# EAGLE schematic atmega328Pruebas (EAGLE 7.6.0)
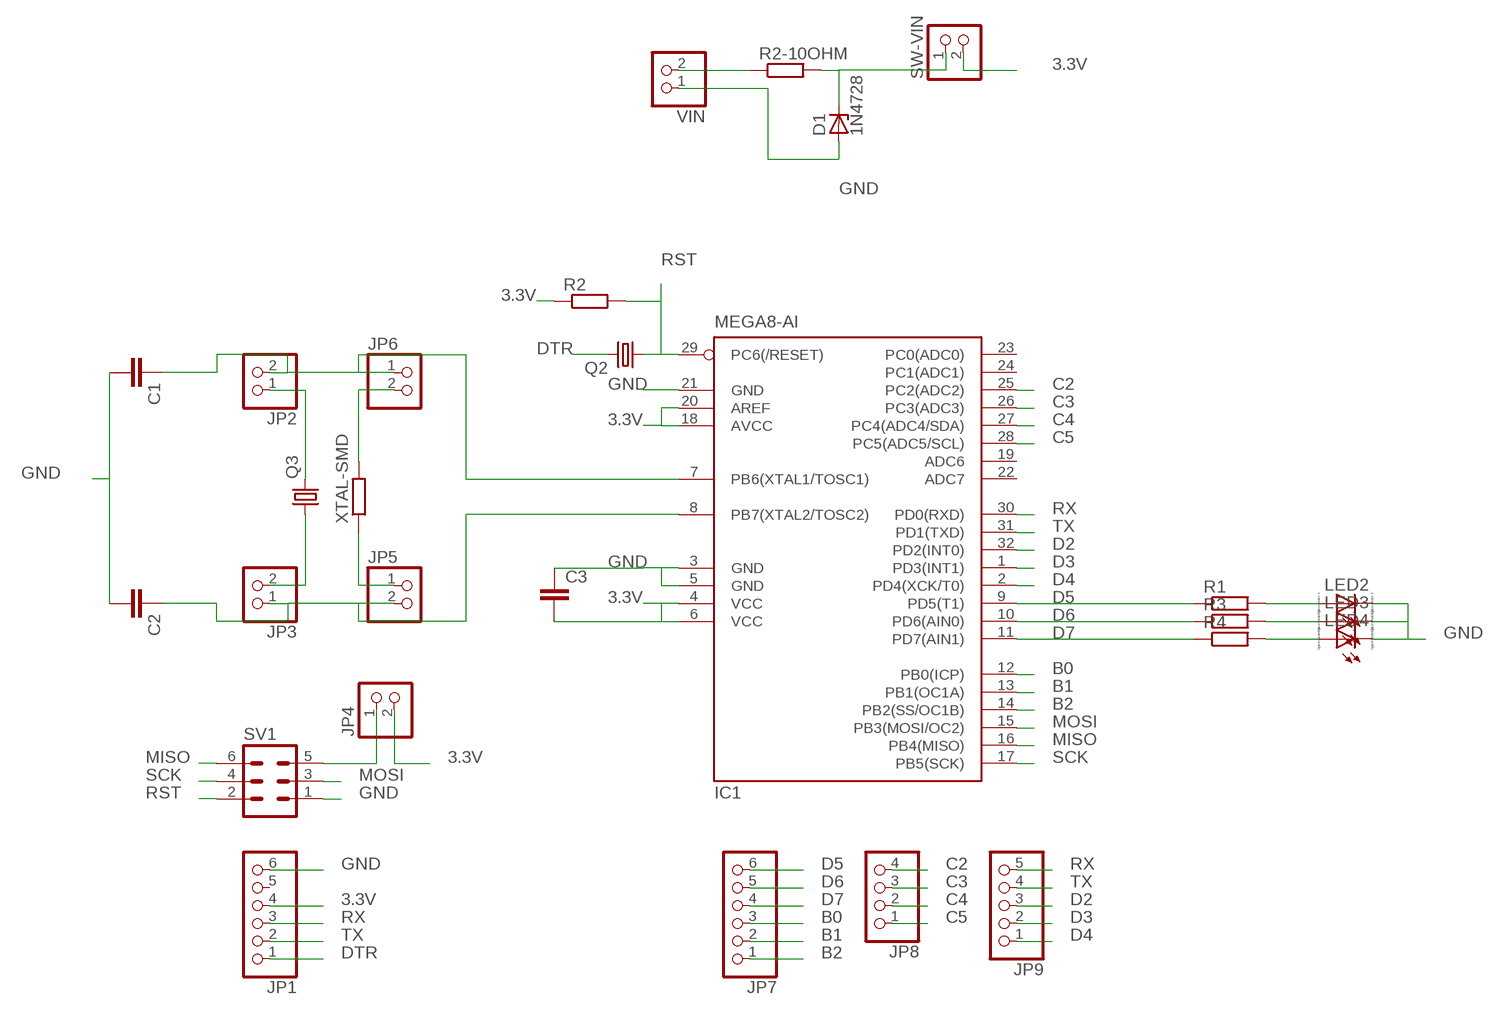
[diagram p0: schematic, sheet 1]

## Parts
C1  C-EUC0402K  [C0402K]
C2  C-EUC0402K  [C0402K]
C3  C-EUC0402K  [C0402K]
D1  1N4728  [DO41Z10]
IC1  MEGA8-AI  [TQFP32-08]
JP1  PINHD-1X6  [1X06]
JP2  PINHD-1X2  [1X02]
JP3  PINHD-1X2  [1X02]
JP4  PINHD-1X2  [1X02]
JP5  PINHD-1X2  [1X02]
JP6  PINHD-1X2  [1X02]
JP7  PINHD-1X6  [1X06]
JP8  PINHD-1X4  [1X04]
JP9  PINHD-1X5  [1X05]
LED2  LED_ESML0603  [LED_SML0603]
LED3  LED_ESML0603  [LED_SML0603]
LED4  LED_ESML0603  [LED_SML0603]
Q2  CRYSTALHC49U70  [HC49U70]
Q3  CRYSTALHC49U70  [HC49U70]
R1  R-EU_R0603  [R0603]
R2  R-EU_R0603  [R0603]
R2-10OHM  R-EU_R2512  [R2512]
R3  R-EU_R0603  [R0603]
R4  R-EU_R0603  [R0603]
SV1  MA03-2  [MA03-2]
SW-VIN  PINHD-1X2  [1X02]
VIN  PINHD-1X2  [1X02]
XTAL-SMD  R-EU_M1206  [M1206]

## Nets
3.3V: C3.2 IC1.4(VCC) IC1.6(VCC) IC1.18(AVCC) IC1.20(AREF) JP1.4 JP4.2 R2.1 SW-VIN.2
B0: IC1.12(PB0(ICP)) JP7.3
B1: IC1.13(PB1(OC1A)) JP7.2
B2: IC1.14(PB2(SS/OC1B)) JP7.1
C2: IC1.25(PC2(ADC2)) JP8.4
C3: IC1.26(PC3(ADC3)) JP8.3
C4: IC1.27(PC4(ADC4/SDA)) JP8.2
C5: IC1.28(PC5(ADC5/SCL)) JP8.1
D2: IC1.32(PD2(INT0)) JP9.3
D3: IC1.1(PD3(INT1)) JP9.2
D4: IC1.2(PD4(XCK/T0)) JP9.1
D5: IC1.9(PD5(T1)) JP7.6 R1.1
D6: IC1.10(PD6(AIN0)) JP7.5 R3.1
D7: IC1.11(PD7(AIN1)) JP7.4 R4.1
DTR: JP1.1 Q2.2
GND: C1.2 C2.2 C3.1 D1.A IC1.3(GND) IC1.5(GND) IC1.21(GND) JP1.6 LED2.C LED3.C LED4.C SV1.1 VIN.1
MISO: IC1.16(PB4(MISO)) SV1.6
MOSI: IC1.15(PB3(MOSI/OC2)) SV1.3
N$1: D1.C R2-10OHM.2 SW-VIN.1
N$2: R2-10OHM.1 VIN.2
N$3: JP2.1 Q3.2
N$4: JP3.2 Q3.1
N$5: JP5.1 XTAL-SMD.1
N$6: JP6.2 XTAL-SMD.2
N$7: C1.1 IC1.7(PB6(XTAL1/TOSC1)) JP2.2 JP6.1
N$8: C2.1 IC1.8(PB7(XTAL2/TOSC2)) JP3.1 JP5.2
N$9: LED2.A R1.2
N$10: LED3.A R3.2
N$11: LED4.A R4.2
N$12: JP4.1 SV1.5
RST: IC1.29(PC6(/RESET)) Q2.1 R2.2 SV1.2
RX: IC1.30(PD0(RXD)) JP1.3 JP9.5
SCK: IC1.17(PB5(SCK)) SV1.4
TX: IC1.31(PD1(TXD)) JP1.2 JP9.4
Unconnected: IC1.19(ADC6) IC1.22(ADC7) IC1.23(PC0(ADC0)) IC1.24(PC1(ADC1)) JP1.5

## Library data of the parts
C1-C3 = rcl:C-EU: CAPACITOR, European symbol
D1 = diode:1N4728: Z DIODE 3.3 V, 1W, 5 percent
IC1 = atmel:MEGA8: MICROCONTROLLER 8 Kbytes FLASH, 1 kbytes SRAM, 512 bytes EEPROM, USART, 6-channel 10 bit ADC, 2-channel 8 bit ADC Pin compatible with Atmega48, ATMega88, ATMega168 Source: avr.lbr; MPN: ATMEGA8-16AU; OC_FARNELL: 9171371; OC_NEWARK: 73M8863
JP1 JP7 = pinhead:PINHD-1X6: PIN HEADER
JP2-JP6 SW-VIN VIN = pinhead:PINHD-1X2: PIN HEADER
JP8 = pinhead:PINHD-1X4: PIN HEADER
JP9 = pinhead:PINHD-1X5: PIN HEADER
LED2-LED4 = eagle-ltspice:LED_E: LED Source: http://www.osram.convergy.de Source: www.luxeon.com Source: www.kingbright.com; SPICEMODEL: NONE; SPICEPREFIX: D; SPICETYPE: diode
Q2 Q3 = crystal:CRYSTAL: CRYSTAL; OC_FARNELL: unknown; OC_NEWARK: unknown
R1-R4 XTAL-SMD = rcl:R-EU_: RESISTOR, European symbol
R2-10OHM = resistor:R-EU_: RESISTOR, European symbol
SV1 = con-lstb:MA03-2: PIN HEADER; OC_FARNELL: unknown; OC_NEWARK: unknown